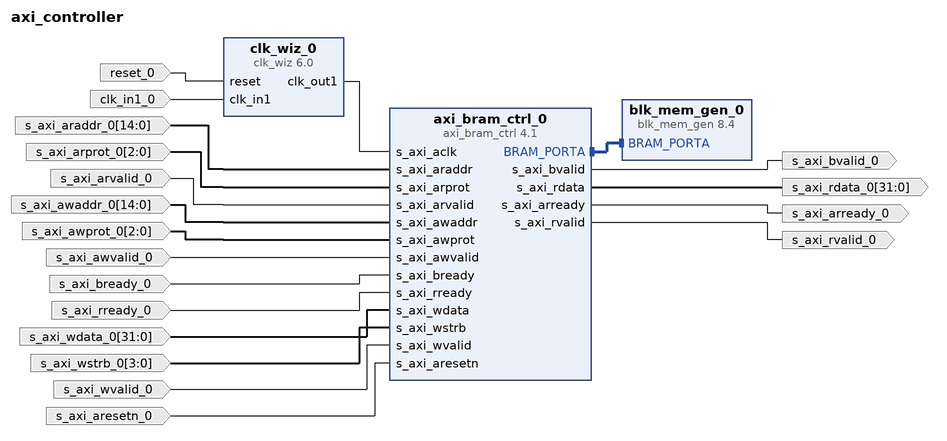
[diagram p0: block diagram of the top level]
# Vivado block design axi_controller, xc7z020clg400-1, Vivado 2020.2
create_bd_design axi_controller

create_bd_port -dir I -from 14 -to 0 s_axi_araddr_0
create_bd_port -dir I -from 2 -to 0 s_axi_arprot_0
create_bd_port -dir I s_axi_arvalid_0
create_bd_port -dir I -from 14 -to 0 s_axi_awaddr_0
create_bd_port -dir I -from 2 -to 0 s_axi_awprot_0
create_bd_port -dir I s_axi_awvalid_0
create_bd_port -dir I s_axi_bready_0
create_bd_port -dir I s_axi_rready_0
create_bd_port -dir I -from 31 -to 0 s_axi_wdata_0
create_bd_port -dir I -from 3 -to 0 s_axi_wstrb_0
create_bd_port -dir I s_axi_wvalid_0
create_bd_port -dir O -from 31 -to 0 s_axi_rdata_0
create_bd_port -dir I -type rst s_axi_aresetn_0
create_bd_port -dir O s_axi_bvalid_0
create_bd_port -dir O s_axi_rvalid_0
create_bd_port -dir O s_axi_arready_0
create_bd_port -dir I -type rst reset_0
set_property -dict {CONFIG.POLARITY ACTIVE_HIGH} [get_bd_ports reset_0]
create_bd_port -dir I -type clk clk_in1_0

create_bd_cell -type ip -vlnv xilinx.com:ip:axi_bram_ctrl:4.1 axi_bram_ctrl_0
set_property -dict {CONFIG.PROTOCOL AXI4LITE CONFIG.SINGLE_PORT_BRAM 1} [get_bd_cells axi_bram_ctrl_0]
create_bd_cell -type ip -vlnv xilinx.com:ip:blk_mem_gen:8.4 blk_mem_gen_0
create_bd_cell -type ip -vlnv xilinx.com:ip:clk_wiz:6.0 clk_wiz_0

# ---- connections ----

connect_bd_intf_net [get_bd_intf_pins blk_mem_gen_0/BRAM_PORTA] [get_bd_intf_pins axi_bram_ctrl_0/BRAM_PORTA]
connect_bd_net -net s_axi_araddr_0_1 [get_bd_ports s_axi_araddr_0] [get_bd_pins axi_bram_ctrl_0/s_axi_araddr]
connect_bd_net -net s_axi_arprot_0_1 [get_bd_ports s_axi_arprot_0] [get_bd_pins axi_bram_ctrl_0/s_axi_arprot]
connect_bd_net -net s_axi_arvalid_0_1 [get_bd_ports s_axi_arvalid_0] [get_bd_pins axi_bram_ctrl_0/s_axi_arvalid]
connect_bd_net -net s_axi_awaddr_0_1 [get_bd_ports s_axi_awaddr_0] [get_bd_pins axi_bram_ctrl_0/s_axi_awaddr]
connect_bd_net -net s_axi_awprot_0_1 [get_bd_ports s_axi_awprot_0] [get_bd_pins axi_bram_ctrl_0/s_axi_awprot]
connect_bd_net -net s_axi_awvalid_0_1 [get_bd_ports s_axi_awvalid_0] [get_bd_pins axi_bram_ctrl_0/s_axi_awvalid]
connect_bd_net -net s_axi_bready_0_1 [get_bd_ports s_axi_bready_0] [get_bd_pins axi_bram_ctrl_0/s_axi_bready]
connect_bd_net -net s_axi_rready_0_1 [get_bd_ports s_axi_rready_0] [get_bd_pins axi_bram_ctrl_0/s_axi_rready]
connect_bd_net -net s_axi_wdata_0_1 [get_bd_ports s_axi_wdata_0] [get_bd_pins axi_bram_ctrl_0/s_axi_wdata]
connect_bd_net -net s_axi_wstrb_0_1 [get_bd_ports s_axi_wstrb_0] [get_bd_pins axi_bram_ctrl_0/s_axi_wstrb]
connect_bd_net -net s_axi_wvalid_0_1 [get_bd_ports s_axi_wvalid_0] [get_bd_pins axi_bram_ctrl_0/s_axi_wvalid]
connect_bd_net [get_bd_pins axi_bram_ctrl_0/s_axi_rdata] [get_bd_ports s_axi_rdata_0]
connect_bd_net -net s_axi_aresetn_0_1 [get_bd_ports s_axi_aresetn_0] [get_bd_pins axi_bram_ctrl_0/s_axi_aresetn]
connect_bd_net [get_bd_pins axi_bram_ctrl_0/s_axi_bvalid] [get_bd_ports s_axi_bvalid_0]
connect_bd_net [get_bd_pins axi_bram_ctrl_0/s_axi_rvalid] [get_bd_ports s_axi_rvalid_0]
connect_bd_net [get_bd_pins axi_bram_ctrl_0/s_axi_arready] [get_bd_ports s_axi_arready_0]
connect_bd_net [get_bd_pins clk_wiz_0/clk_out1] [get_bd_pins axi_bram_ctrl_0/s_axi_aclk]
connect_bd_net -net reset_0_1 [get_bd_ports reset_0] [get_bd_pins clk_wiz_0/reset]
connect_bd_net -net clk_in1_0_1 [get_bd_ports clk_in1_0] [get_bd_pins clk_wiz_0/clk_in1]

validate_bd_design
save_bd_design
